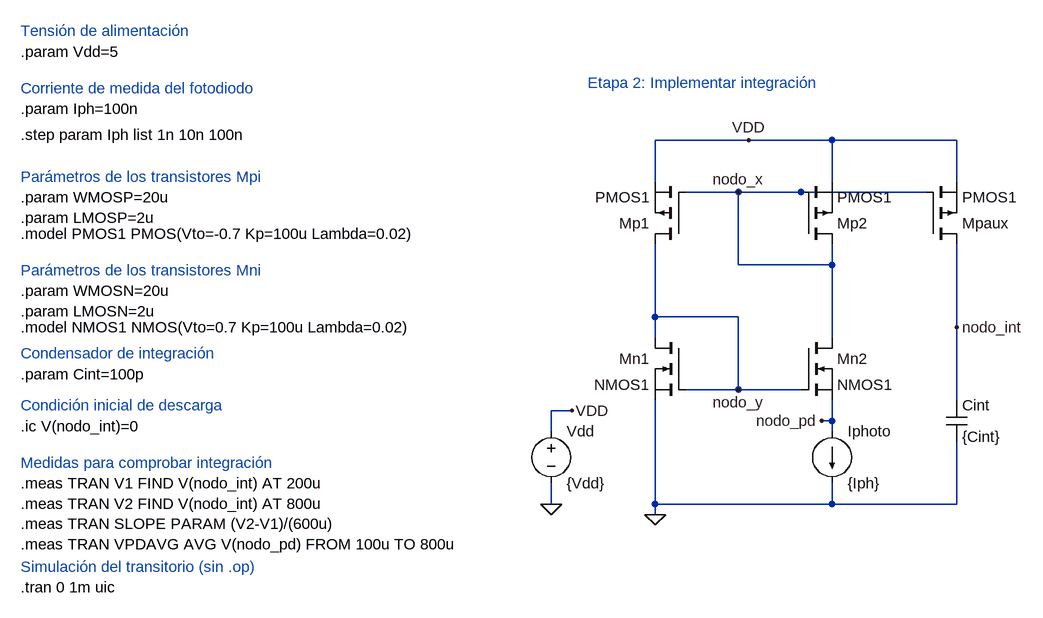
[diagram p0: schematic CMI_Etapa2.asc]
CMI_Etapa2.asc, the LTspice schematic file:
Version 4.1
SHEET 1 880 680
WIRE 144 -496 0 -496
WIRE 272 -496 144 -496
WIRE 464 -496 272 -496
WIRE 0 -432 0 -496
WIRE 272 -432 272 -496
WIRE 464 -432 464 -496
WIRE 128 -416 48 -416
WIRE 224 -416 128 -416
WIRE 416 -416 224 -416
WIRE 128 -304 128 -416
WIRE 272 -304 272 -336
WIRE 272 -304 128 -304
WIRE 0 -224 0 -336
WIRE 128 -224 0 -224
WIRE 464 -208 464 -336
WIRE 0 -192 0 -224
WIRE 272 -192 272 -304
WIRE 128 -112 128 -224
WIRE 128 -112 48 -112
WIRE 224 -112 128 -112
WIRE 464 -96 464 -208
WIRE -128 -80 -160 -80
WIRE 272 -64 272 -96
WIRE 272 -64 256 -64
WIRE -160 -48 -160 -80
WIRE 272 -48 272 -64
WIRE -160 64 -160 32
WIRE 0 64 0 -96
WIRE 272 64 272 32
WIRE 272 64 0 64
WIRE 464 64 464 -32
WIRE 464 64 272 64
WIRE 0 80 0 64
FLAG 144 -496 VDD
FLAG 0 80 0
FLAG 256 -64 nodo_pd
FLAG 128 -416 nodo_x
FLAG 128 -112 nodo_y
FLAG -160 64 0
FLAG -128 -80 VDD
FLAG 464 -208 nodo_int
SYMBOL current 272 -48 R0
SYMATTR InstName Iphoto
SYMATTR Value {Iph}
SYMBOL nmos 48 -192 M0
SYMATTR InstName Mn1
SYMATTR Value NMOS1
SYMATTR SpiceLine L={LMOSN} W={WMOSN}
SYMBOL nmos 224 -192 R0
SYMATTR InstName Mn2
SYMATTR Value NMOS1
SYMATTR SpiceLine L={LMOSN} W={WMOSN}
SYMBOL pmos 48 -336 R180
SYMATTR InstName Mp1
SYMATTR Value PMOS1
SYMATTR SpiceLine L={LMOSP} W={WMOSP}
SYMBOL pmos 224 -336 M180
SYMATTR InstName Mp2
SYMATTR Value PMOS1
SYMATTR SpiceLine L={LMOSP} W={WMOSP}
SYMBOL voltage -160 -64 R0
SYMATTR InstName Vdd
SYMATTR Value {Vdd}
SYMBOL pmos 416 -336 M180
SYMATTR InstName Mpaux
SYMATTR Value PMOS1
SYMATTR SpiceLine L={LMOSP} W={WMOSP}
SYMBOL cap 448 -96 R0
SYMATTR InstName Cint
SYMATTR Value {Cint}
TEXT -104 -584 Left 2 ;Etapa 2: Implementar integración
TEXT -976 -576 Left 2 ;Corriente de medida del fotodiodo
TEXT -976 -544 Left 2 !.param Iph=100n
TEXT -976 -504 Left 2 !.step param Iph list 1n 10n 100n
TEXT -976 -408 Left 2 !.param WMOSP=20u\n.param LMOSP=2u
TEXT -976 -440 Left 2 ;Parámetros de los transistores Mpi
TEXT -976 -352 Left 2 !.model PMOS1 PMOS(Vto=-0.7 Kp=100u Lambda=0.02)
TEXT -976 -264 Left 2 !.param WMOSN=20u\n.param LMOSN=2u
TEXT -976 -296 Left 2 ;Parámetros de los transistores Mni
TEXT -976 -208 Left 2 !.model NMOS1 NMOS(Vto=0.7 Kp=100u Lambda=0.02)
TEXT -976 -664 Left 2 ;Tensión de alimentación
TEXT -976 -632 Left 2 !.param Vdd=5
TEXT -976 192 Left 2 !.tran 0 1m uic
TEXT -976 160 Left 2 ;Simulación del transitorio (sin .op)
TEXT -976 -168 Left 2 ;Condensador de integración
TEXT -976 -136 Left 2 !.param Cint=100p
TEXT -976 -88 Left 2 ;Condición inicial de descarga
TEXT -976 -56 Left 2 !.ic V(nodo_int)=0
TEXT -976 0 Left 2 ;Medidas para comprobar integración
TEXT -976 32 Left 2 !.meas TRAN V1 FIND V(nodo_int) AT 200u\n.meas TRAN V2 FIND V(nodo_int) AT 800u\n.meas TRAN SLOPE PARAM (V2-V1)/(600u)\n.meas TRAN VPDAVG AVG V(nodo_pd) FROM 100u TO 800u

The netlist it stands for:
* CMI_Etapa2.asc
Iphoto nodo_pd 0 {Iph}
Mn1 nodo_y nodo_y 0 0 NMOS1 L={LMOSN} W={WMOSN}
Mn2 nodo_x nodo_y nodo_pd nodo_pd NMOS1 L={LMOSN} W={WMOSN}
Mp1 nodo_y nodo_x VDD VDD PMOS1 L={LMOSP} W={WMOSP}
Mp2 nodo_x nodo_x VDD VDD PMOS1 L={LMOSP} W={WMOSP}
Vdd VDD 0 {Vdd}
Mpaux nodo_int nodo_x VDD VDD PMOS1 L={LMOSP} W={WMOSP}
Cint nodo_int 0 {Cint}
.model NMOS NMOS
.model PMOS PMOS
.lib standard.mos
* Etapa 2: Implementar integración
* Corriente de medida del fotodiodo
.param Iph=100n
.step param Iph list 1n 10n 100n
.param WMOSP=20u
.param LMOSP=2u
* Parámetros de los transistores Mpi
.model PMOS1 PMOS(Vto=-0.7 Kp=100u Lambda=0.02)
.param WMOSN=20u
.param LMOSN=2u
* Parámetros de los transistores Mni
.model NMOS1 NMOS(Vto=0.7 Kp=100u Lambda=0.02)
* Tensión de alimentación
.param Vdd=5
.tran 0 1m uic
* Simulación del transitorio (sin .op)
* Condensador de integración
.param Cint=100p
* Condición inicial de descarga
.ic V(nodo_int)=0
* Medidas para comprobar integración
.meas TRAN V1 FIND V(nodo_int) AT 200u
.meas TRAN V2 FIND V(nodo_int) AT 800u
.meas TRAN SLOPE PARAM (V2-V1)/(600u)
.meas TRAN VPDAVG AVG V(nodo_pd) FROM 100u TO 800u
.backanno
.end

* Results of the author's LTspice run, read from the files saved beside the schematic
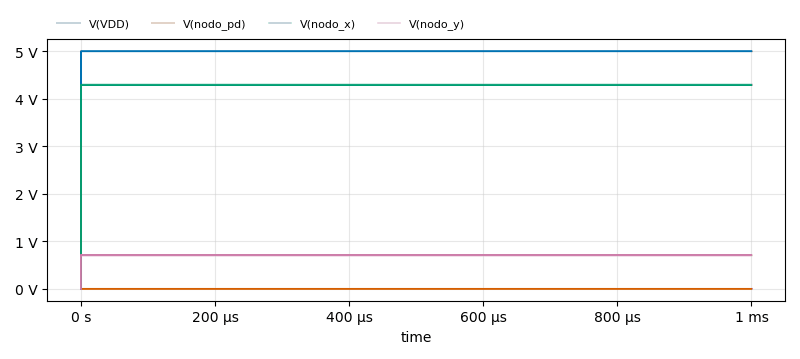
[diagram p1: Transient Analysis of CMI_Etapa2.asc, plotted from the saved traces]
* Transient Analysis, 3 runs:
*   V(VDD) [iph=1e-09]: min 0 V, max 5 V, average 5 V, rms 5 V, last 5 V
*   V(VDD) [iph=1e-08]: min 0 V, max 5 V, average 5 V, rms 5 V, last 5 V
*   V(VDD) [iph=1e-07]: min 0 V, max 5 V, average 5 V, rms 5 V, last 5 V
*   V(nodo_pd) [iph=1e-09]: min 0 V, max 3.321 V, average 106 µV, rms 106 µV, last 106 µV
*   V(nodo_pd) [iph=1e-08]: min 0 V, max 3.076 V, average 307 µV, rms 307 µV, last 307 µV
*   V(nodo_pd) [iph=1e-07]: min 0 V, max 1.236 V, average 956.6 µV, rms 956.6 µV, last 956.6 µV
*   V(nodo_x) [iph=1e-09]: min 0 V, max 4.299 V, average 4.299 V, rms 4.299 V, last 4.299 V
*   V(nodo_x) [iph=1e-08]: min 0 V, max 4.296 V, average 4.296 V, rms 4.296 V, last 4.296 V
*   V(nodo_x) [iph=1e-07]: min 0 V, max 4.287 V, average 4.286 V, rms 4.286 V, last 4.286 V
*   V(nodo_y) [iph=1e-09]: min 0 V, max 703.5 mV, average 701.5 mV, rms 701.5 mV, last 701.5 mV
*   V(nodo_y) [iph=1e-08]: min 0 V, max 708.2 mV, average 704.6 mV, rms 704.6 mV, last 704.6 mV
*   V(nodo_y) [iph=1e-07]: min 0 V, max 719.8 mV, average 714.5 mV, rms 714.5 mV, last 714.5 mV
* From the log:
*   Measurement: v1
*     step  V(nodo_int)   at
*        1  0.00218647264679  0.0002
*        2  0.021706970227  0.0002
*        3  0.216491748193  0.0002
*   Measurement: v2
*     step  V(nodo_int)   at
*        1  0.00874532131587  0.0008
*        2  0.0867760156536  0.0008
*        3  0.860862796589  0.0008
*   Measurement: slope
*     step  (V2-V1)/(600u)
*        1  10.9314144485
*        2  108.448409044
*        3  1073.95174733
*   Measurement: vpdavg
*     step  AVG(V(nodo_pd) )  FROM  TO
*        1  0.000105982740934  0.0001  0.0008
*        2  0.000306984555209  0.0001  0.0008
*        3  0.00095664500259  0.0001  0.0008